# EasyEDA Pro project ESP32C3_Motor_MainControl.eprj, board ESP32C3RLogo
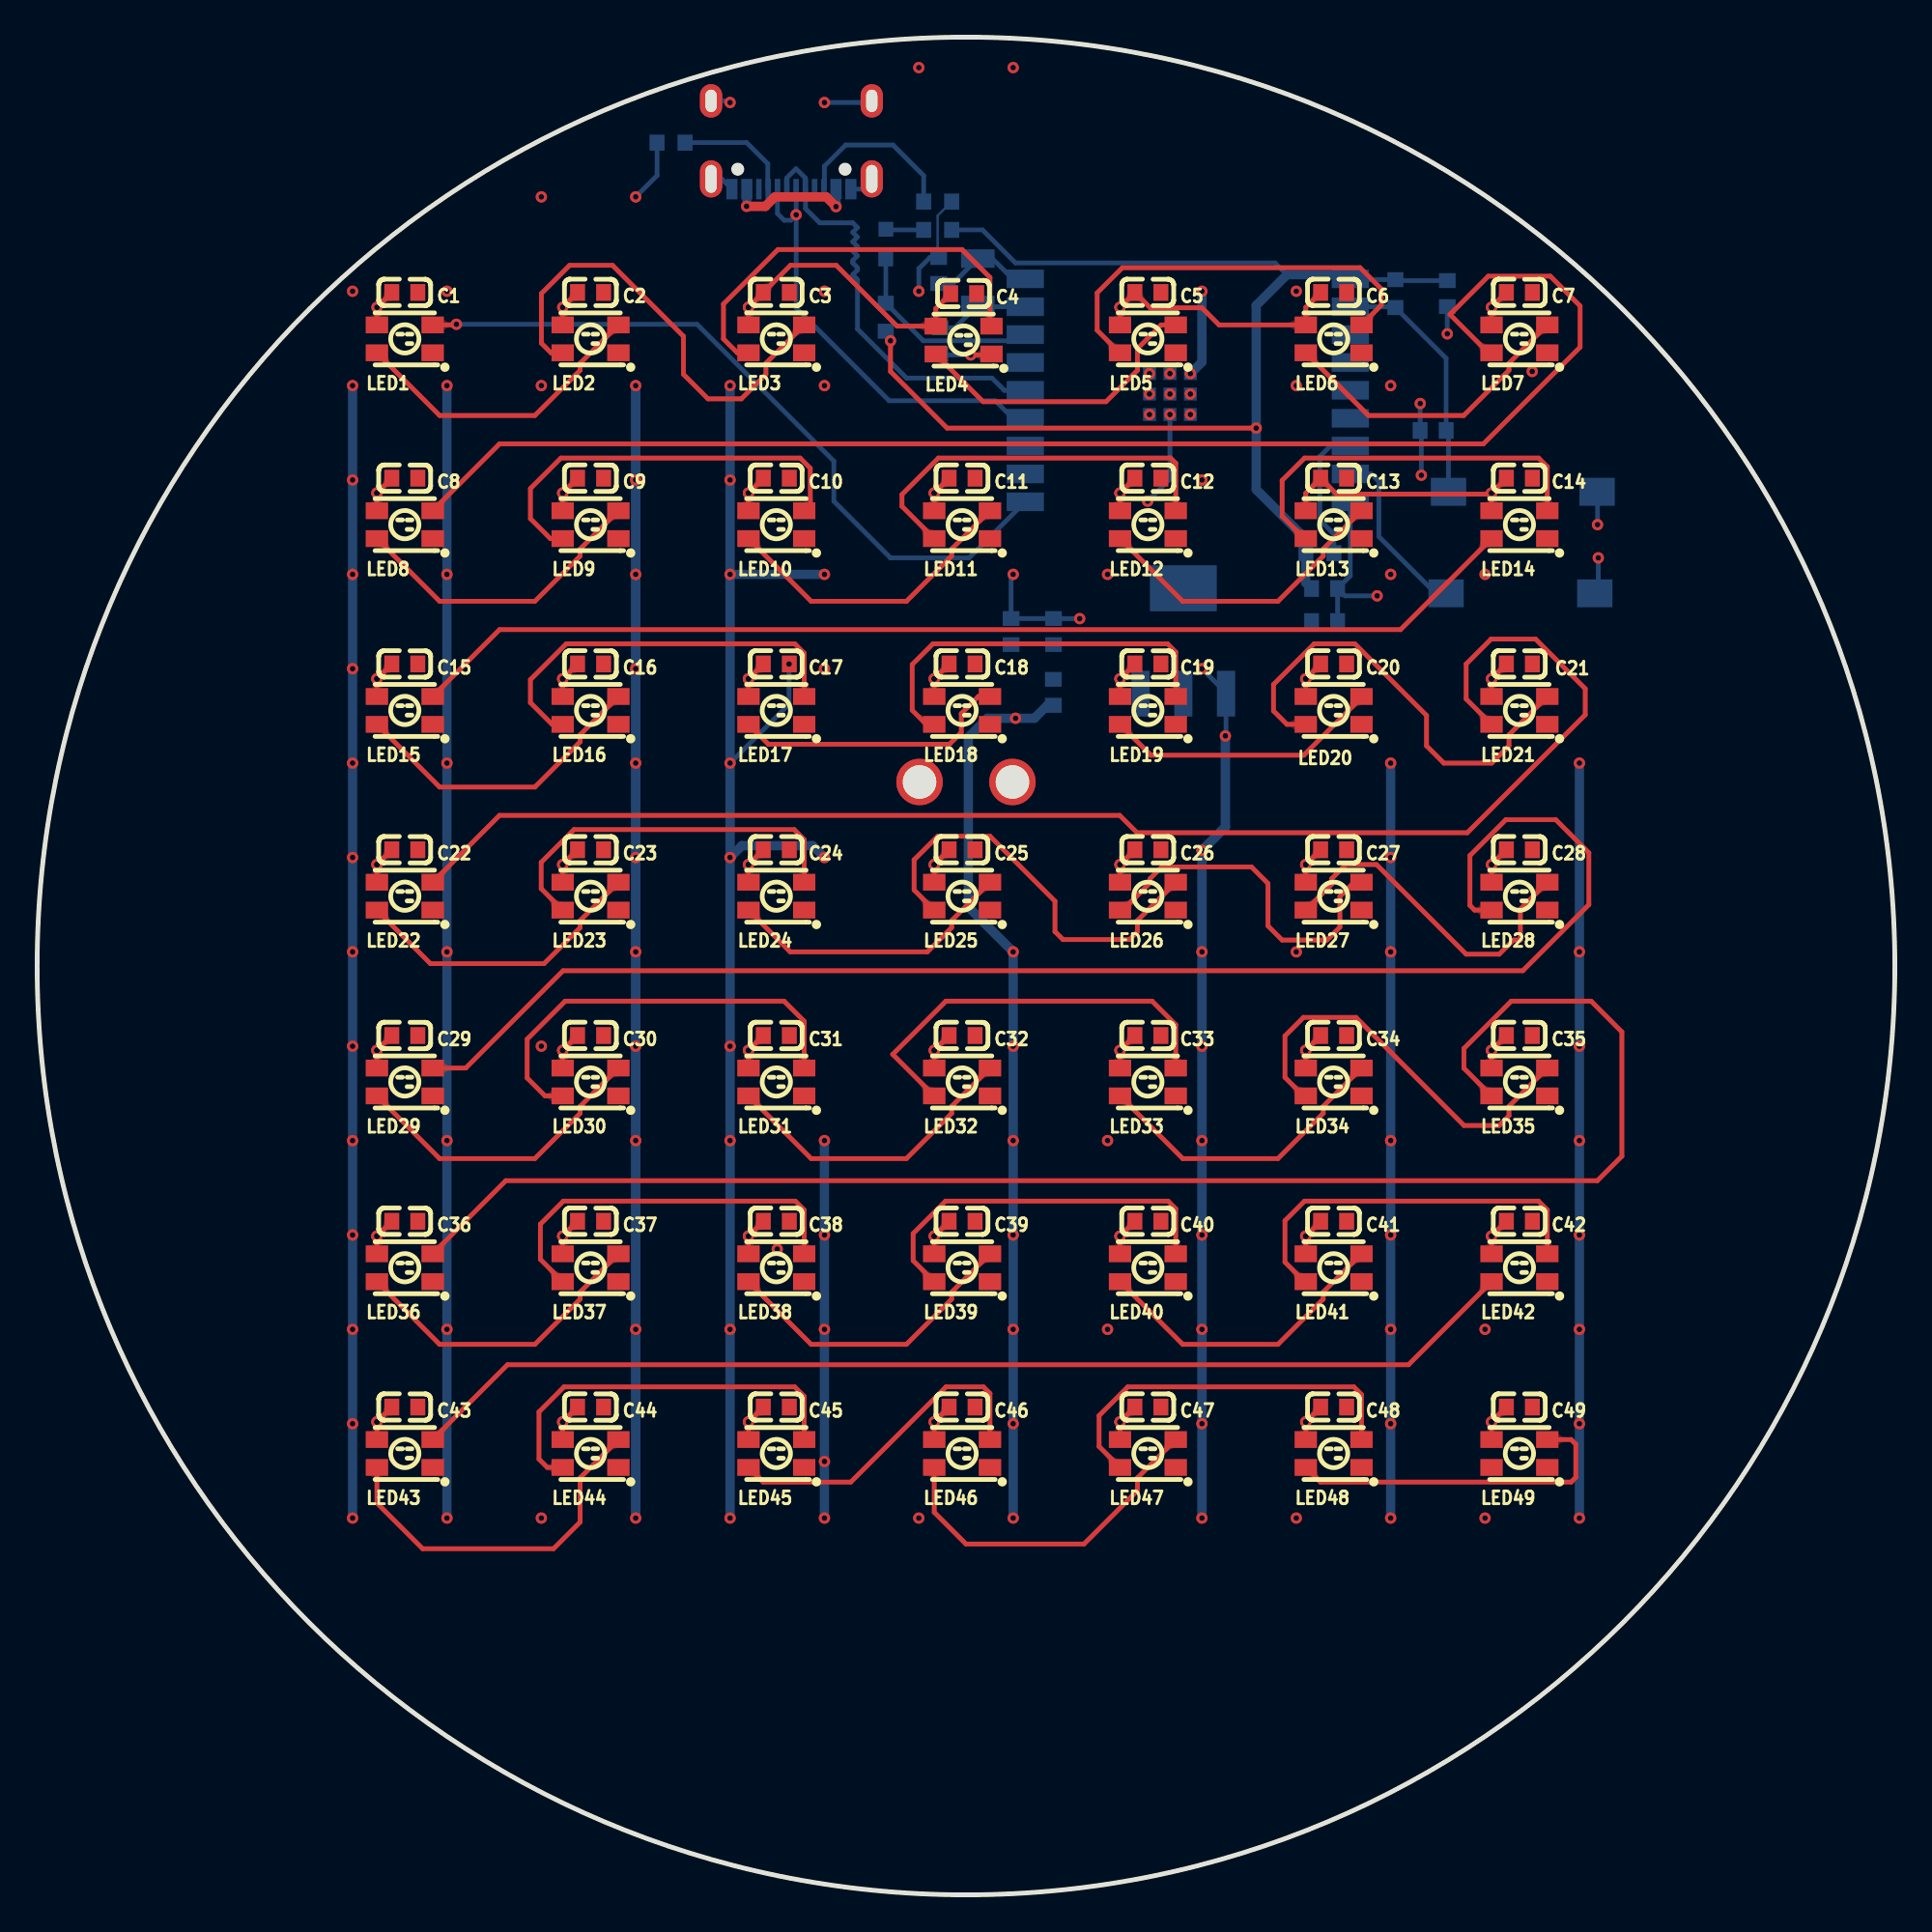
[diagram p5: board, top side]
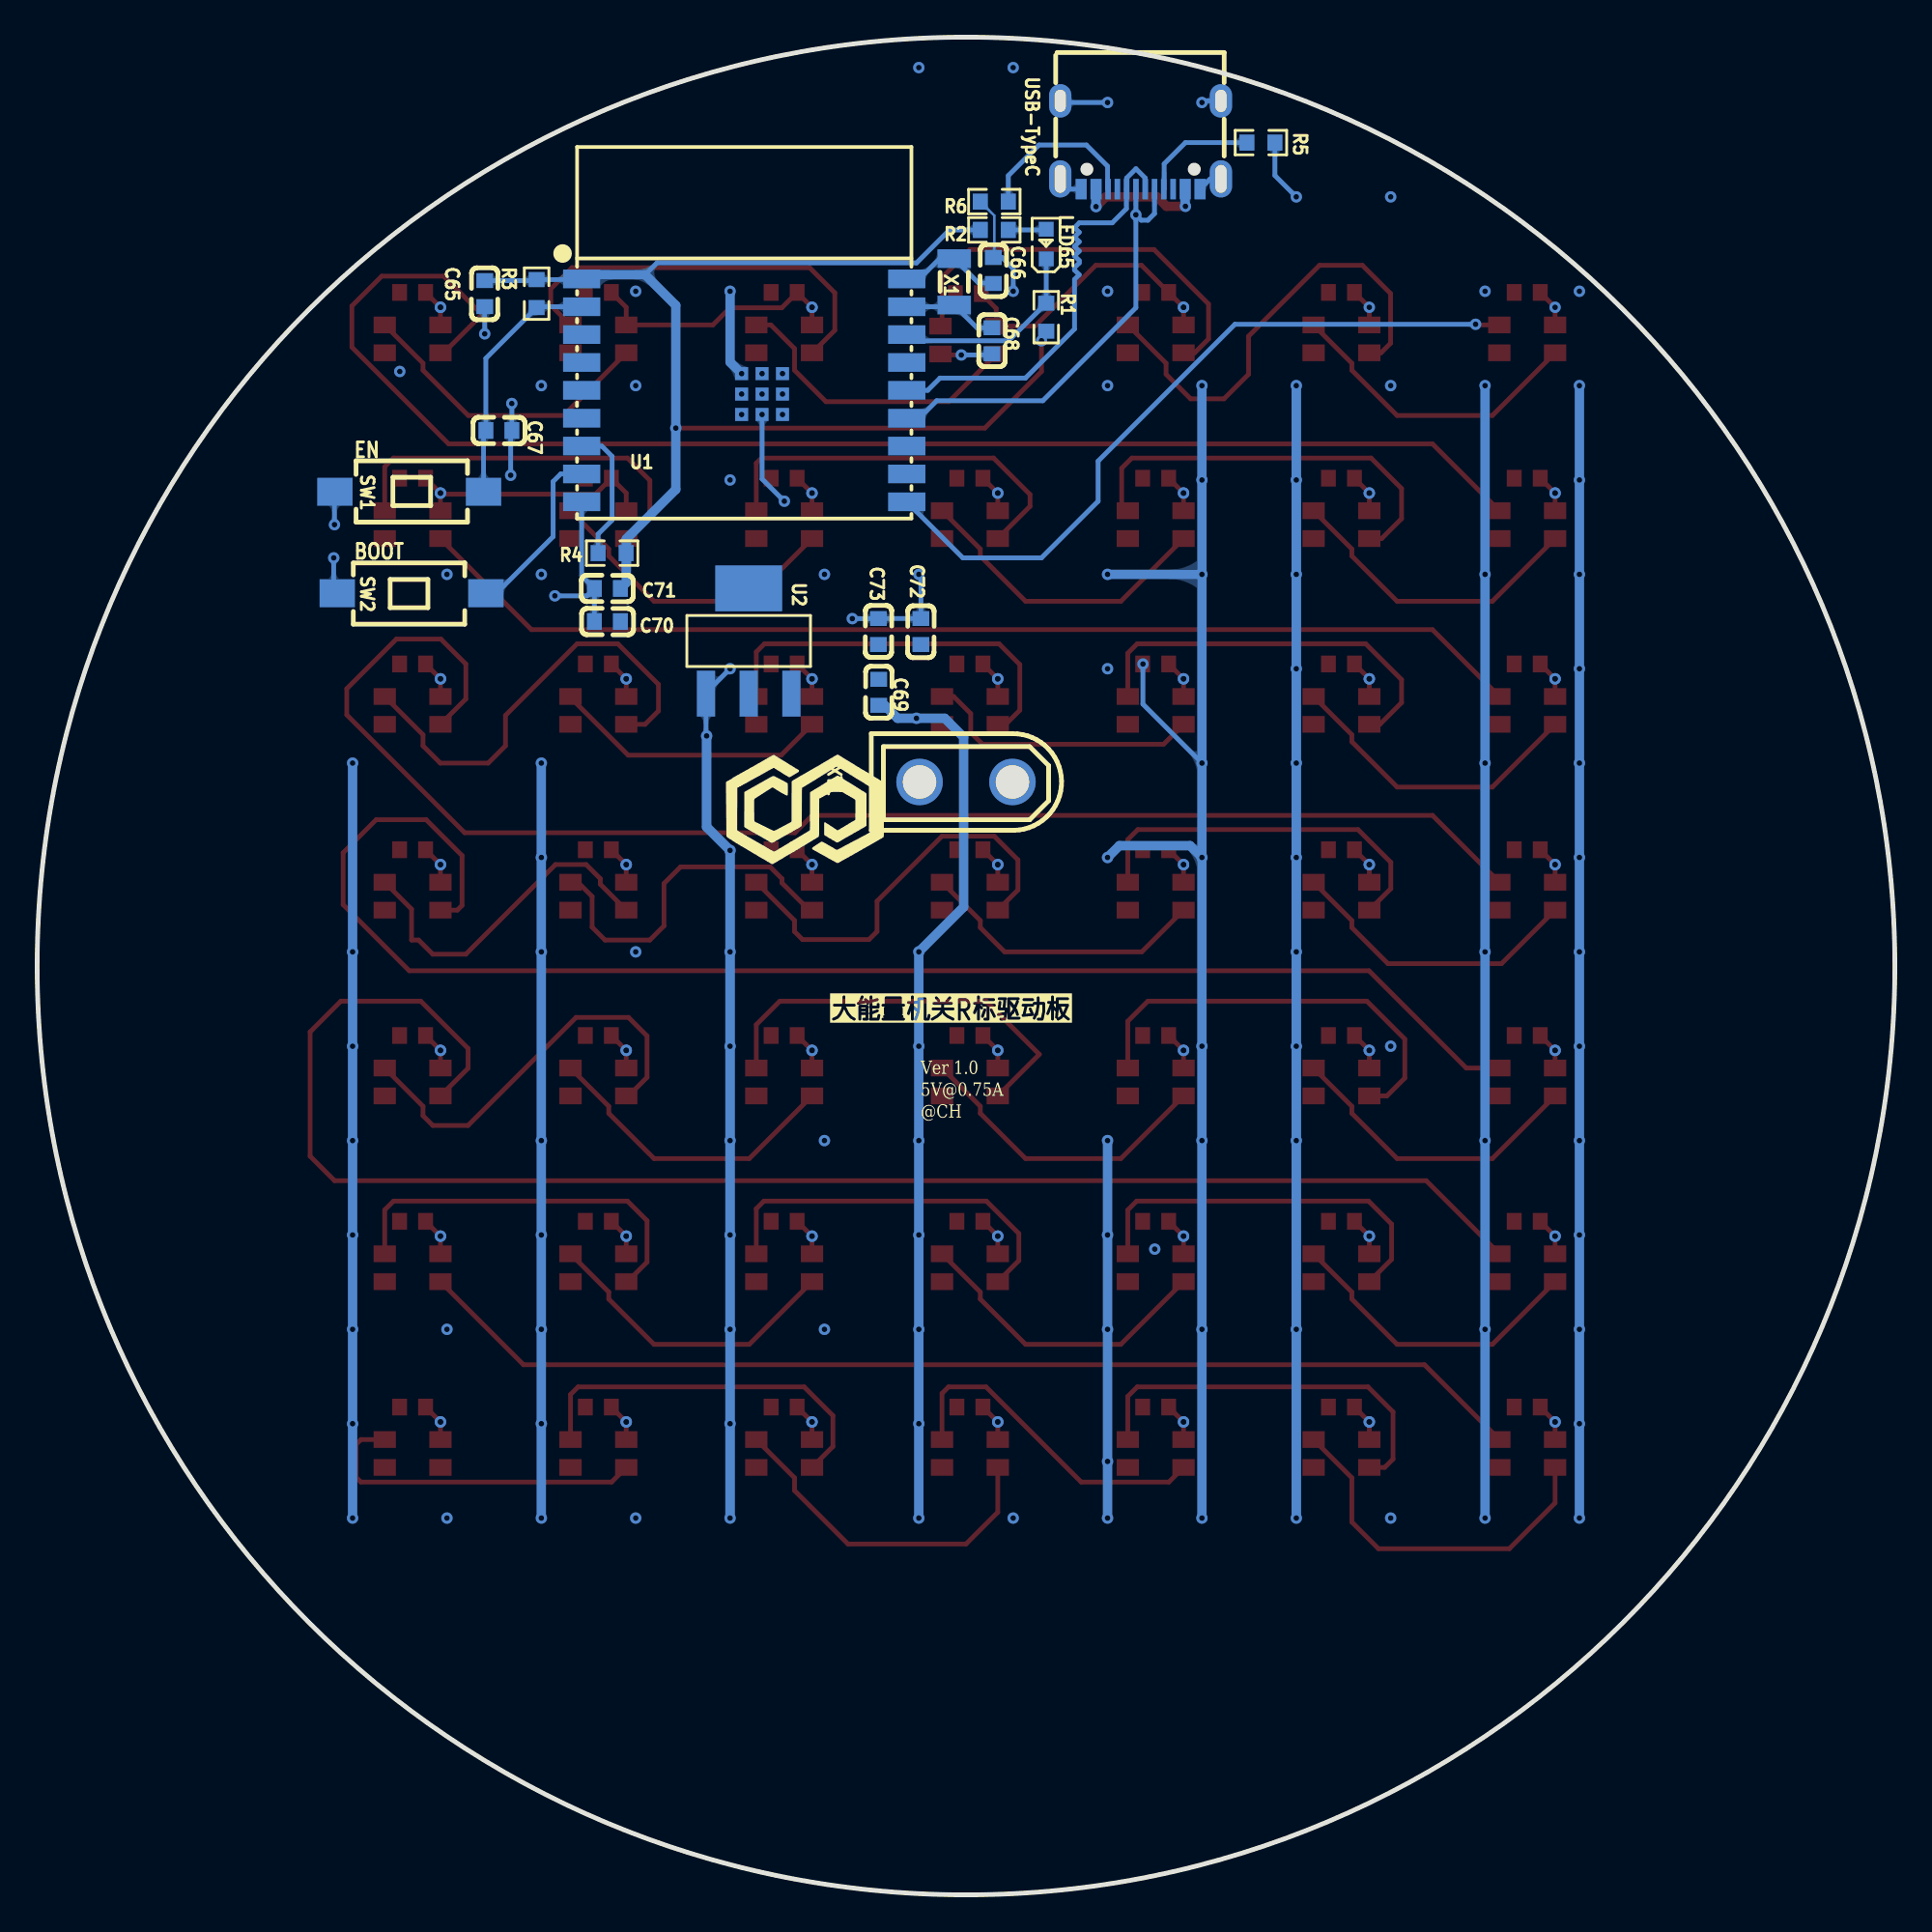
[diagram p6: board, bottom side, seen from below]

Outline 100 x 100 mm; copper layers: Top Layer, Bottom Layer. Coordinates in mm from the lower left corner of the outline.
Outline path: circle c50,50 r50
Stack: Top Layer 0.035mm / Dielectric1 1.51mm FR4 er 4.5 / Bottom Layer 0.035mm

## Design rules (mm)
net USB_DN: DP1
net USB_DP: DP1
template: 自定义配置
spacing copperThickness1oz (default): track to track 0.152, other pairs 0.152 to 0.3
spacing copperThickness2oz: track to track 0.203, other pairs 0.152 to 0.3
track width copperThickness1oz (default): min 0.127, default 0.254, max 2.54
track width copperThickness2oz: min 0.203, default 0.254, max 2.54
differential pair differentialPair (default): width min 0.127, default 0.254, max 2.54; gap min 0.152, default 0.152
via viaSize (default): diameter min 0.5, default 0.61, max 10; hole min 0.3, default 0.305, max 6.299

## Placement (name value [footprint] x y rotation side)
C1  100nF  [C0603]  19.79 86.26 0 top
C2  100nF  [C0603]  29.79 86.26 0 top
C3  100nF  [C0603]  39.79 86.26 0 top
C4  100nF  [C0603]  49.87 86.19 0 top
C5  100nF  [C0603]  59.79 86.26 0 top
C6  100nF  [C0603]  69.79 86.26 0 top
C7  100nF  [C0603]  79.79 86.26 0 top
C8  100nF  [C0603]  19.79 76.26 0 top
C9  100nF  [C0603]  29.79 76.26 0 top
C10  100nF  [C0603]  39.79 76.26 0 top
C11  100nF  [C0603]  49.79 76.26 0 top
C12  100nF  [C0603]  59.79 76.26 0 top
C13  100nF  [C0603]  69.79 76.26 0 top
C14  100nF  [C0603]  79.79 76.26 0 top
C15  100nF  [C0603]  19.79 66.26 0 top
C16  100nF  [C0603]  29.79 66.26 0 top
C17  100nF  [C0603]  39.79 66.26 0 top
C18  100nF  [C0603]  49.79 66.26 0 top
C19  100nF  [C0603]  59.79 66.26 0 top
C20  100nF  [C0603]  69.79 66.26 0 top
C21  100nF  [C0603]  79.79 66.26 0 top
C22  100nF  [C0603]  19.79 56.26 0 top
C23  100nF  [C0603]  29.79 56.26 0 top
C24  100nF  [C0603]  39.79 56.26 0 top
C25  100nF  [C0603]  49.79 56.26 0 top
C26  100nF  [C0603]  59.79 56.26 0 top
C27  100nF  [C0603]  69.79 56.26 0 top
C28  100nF  [C0603]  79.79 56.26 0 top
C29  100nF  [C0603]  19.79 46.26 0 top
C30  100nF  [C0603]  29.79 46.26 0 top
C31  100nF  [C0603]  39.79 46.26 0 top
C32  100nF  [C0603]  49.79 46.26 0 top
C33  100nF  [C0603]  59.79 46.26 0 top
C34  100nF  [C0603]  69.79 46.26 0 top
C35  100nF  [C0603]  79.79 46.26 0 top
C36  100nF  [C0603]  19.79 36.26 0 top
C37  100nF  [C0603]  29.79 36.26 0 top
C38  100nF  [C0603]  39.79 36.26 0 top
C39  100nF  [C0603]  49.79 36.26 0 top
C40  100nF  [C0603]  59.79 36.26 0 top
C41  100nF  [C0603]  69.79 36.26 0 top
C42  100nF  [C0603]  79.79 36.26 0 top
C43  100nF  [C0603]  19.79 26.26 0 top
C44  100nF  [C0603]  29.79 26.26 0 top
C45  100nF  [C0603]  39.79 26.26 0 top
C46  100nF  [C0603]  49.79 26.26 0 top
C47  100nF  [C0603]  59.79 26.26 0 top
C48  100nF  [C0603]  69.79 26.26 0 top
C49  100nF  [C0603]  79.79 26.26 0 top
C65  100nF  [C0603]  75.91 86.19 90 bottom
C66  12pF  [C0603]  48.53 87.44 90 bottom
C67  1uF  [C0603]  75.15 78.83 0 bottom
C68  12pF  [C0603]  48.6 83.66 270 bottom
C69  10uF  [C0603]  54.7 64.73 270 bottom
C70  10uF  [C0603]  69.3 68.54 0 bottom
C71  0.1uF  [C0603]  69.3 70.32 180 bottom
C72  0.1uF  [C0603]  52.43 68 90 bottom
C73  10uF  [C0603]  54.71 68 270 bottom
LED1  XL-3528RGBW-WS2812B  [LED-SMD_4P-L3.5-W2.8-BR-1]  19.79 83.76 0 top
LED2  XL-3528RGBW-WS2812B  [LED-SMD_4P-L3.5-W2.8-BR-1]  29.79 83.76 0 top
LED3  XL-3528RGBW-WS2812B  [LED-SMD_4P-L3.5-W2.8-BR-1]  39.79 83.76 0 top
LED4  XL-3528RGBW-WS2812B  [LED-SMD_4P-L3.5-W2.8-BR-1]  49.87 83.69 0 top
LED5  XL-3528RGBW-WS2812B  [LED-SMD_4P-L3.5-W2.8-BR-1]  59.79 83.76 0 top
LED6  XL-3528RGBW-WS2812B  [LED-SMD_4P-L3.5-W2.8-BR-1]  69.79 83.76 0 top
LED7  XL-3528RGBW-WS2812B  [LED-SMD_4P-L3.5-W2.8-BR-1]  79.79 83.76 0 top
LED8  XL-3528RGBW-WS2812B  [LED-SMD_4P-L3.5-W2.8-BR-1]  19.79 73.76 0 top
LED9  XL-3528RGBW-WS2812B  [LED-SMD_4P-L3.5-W2.8-BR-1]  29.79 73.76 0 top
LED10  XL-3528RGBW-WS2812B  [LED-SMD_4P-L3.5-W2.8-BR-1]  39.79 73.76 0 top
LED11  XL-3528RGBW-WS2812B  [LED-SMD_4P-L3.5-W2.8-BR-1]  49.79 73.76 0 top
LED12  XL-3528RGBW-WS2812B  [LED-SMD_4P-L3.5-W2.8-BR-1]  59.79 73.76 0 top
LED13  XL-3528RGBW-WS2812B  [LED-SMD_4P-L3.5-W2.8-BR-1]  69.79 73.76 0 top
LED14  XL-3528RGBW-WS2812B  [LED-SMD_4P-L3.5-W2.8-BR-1]  79.79 73.76 0 top
LED15  XL-3528RGBW-WS2812B  [LED-SMD_4P-L3.5-W2.8-BR-1]  19.79 63.76 0 top
LED16  XL-3528RGBW-WS2812B  [LED-SMD_4P-L3.5-W2.8-BR-1]  29.79 63.76 0 top
LED17  XL-3528RGBW-WS2812B  [LED-SMD_4P-L3.5-W2.8-BR-1]  39.79 63.76 0 top
LED18  XL-3528RGBW-WS2812B  [LED-SMD_4P-L3.5-W2.8-BR-1]  49.79 63.76 0 top
LED19  XL-3528RGBW-WS2812B  [LED-SMD_4P-L3.5-W2.8-BR-1]  59.79 63.76 0 top
LED20  XL-3528RGBW-WS2812B  [LED-SMD_4P-L3.5-W2.8-BR-1]  69.79 63.76 0 top
LED21  XL-3528RGBW-WS2812B  [LED-SMD_4P-L3.5-W2.8-BR-1]  79.79 63.76 0 top
LED22  XL-3528RGBW-WS2812B  [LED-SMD_4P-L3.5-W2.8-BR-1]  19.79 53.76 0 top
LED23  XL-3528RGBW-WS2812B  [LED-SMD_4P-L3.5-W2.8-BR-1]  29.79 53.76 0 top
LED24  XL-3528RGBW-WS2812B  [LED-SMD_4P-L3.5-W2.8-BR-1]  39.79 53.76 0 top
LED25  XL-3528RGBW-WS2812B  [LED-SMD_4P-L3.5-W2.8-BR-1]  49.79 53.76 0 top
LED26  XL-3528RGBW-WS2812B  [LED-SMD_4P-L3.5-W2.8-BR-1]  59.79 53.76 0 top
LED27  XL-3528RGBW-WS2812B  [LED-SMD_4P-L3.5-W2.8-BR-1]  69.79 53.76 0 top
LED28  XL-3528RGBW-WS2812B  [LED-SMD_4P-L3.5-W2.8-BR-1]  79.79 53.76 0 top
LED29  XL-3528RGBW-WS2812B  [LED-SMD_4P-L3.5-W2.8-BR-1]  19.79 43.76 0 top
LED30  XL-3528RGBW-WS2812B  [LED-SMD_4P-L3.5-W2.8-BR-1]  29.79 43.76 0 top
LED31  XL-3528RGBW-WS2812B  [LED-SMD_4P-L3.5-W2.8-BR-1]  39.79 43.76 0 top
LED32  XL-3528RGBW-WS2812B  [LED-SMD_4P-L3.5-W2.8-BR-1]  49.79 43.76 0 top
LED33  XL-3528RGBW-WS2812B  [LED-SMD_4P-L3.5-W2.8-BR-1]  59.79 43.76 0 top
LED34  XL-3528RGBW-WS2812B  [LED-SMD_4P-L3.5-W2.8-BR-1]  69.79 43.76 0 top
LED35  XL-3528RGBW-WS2812B  [LED-SMD_4P-L3.5-W2.8-BR-1]  79.79 43.76 0 top
LED36  XL-3528RGBW-WS2812B  [LED-SMD_4P-L3.5-W2.8-BR-1]  19.79 33.76 0 top
LED37  XL-3528RGBW-WS2812B  [LED-SMD_4P-L3.5-W2.8-BR-1]  29.79 33.76 0 top
LED38  XL-3528RGBW-WS2812B  [LED-SMD_4P-L3.5-W2.8-BR-1]  39.79 33.76 0 top
LED39  XL-3528RGBW-WS2812B  [LED-SMD_4P-L3.5-W2.8-BR-1]  49.79 33.76 0 top
LED40  XL-3528RGBW-WS2812B  [LED-SMD_4P-L3.5-W2.8-BR-1]  59.79 33.76 0 top
LED41  XL-3528RGBW-WS2812B  [LED-SMD_4P-L3.5-W2.8-BR-1]  69.79 33.76 0 top
LED42  XL-3528RGBW-WS2812B  [LED-SMD_4P-L3.5-W2.8-BR-1]  79.79 33.76 0 top
LED43  XL-3528RGBW-WS2812B  [LED-SMD_4P-L3.5-W2.8-BR-1]  19.79 23.76 0 top
LED44  XL-3528RGBW-WS2812B  [LED-SMD_4P-L3.5-W2.8-BR-1]  29.79 23.76 0 top
LED45  XL-3528RGBW-WS2812B  [LED-SMD_4P-L3.5-W2.8-BR-1]  39.79 23.76 0 top
LED46  XL-3528RGBW-WS2812B  [LED-SMD_4P-L3.5-W2.8-BR-1]  49.79 23.76 0 top
LED47  XL-3528RGBW-WS2812B  [LED-SMD_4P-L3.5-W2.8-BR-1]  59.79 23.76 0 top
LED48  XL-3528RGBW-WS2812B  [LED-SMD_4P-L3.5-W2.8-BR-1]  69.79 23.76 0 top
LED49  XL-3528RGBW-WS2812B  [LED-SMD_4P-L3.5-W2.8-BR-1]  79.79 23.76 0 top
LED65  NCD0603R1  [LED0603-RD_RED]  45.68 88.86 90 bottom
R1  10kΩ  [R0603]  45.68 84.92 90 bottom
R2  1kΩ  [R0603]  48.48 89.62 0 bottom
R3  10kΩ  [R0603]  73.11 86.19 90 bottom
R4  10kΩ  [R0603]  69.05 72.22 180 bottom
R5  5.1kΩ  [R0603]  34.12 94.32 0 bottom
R6  5.1kΩ  [R0603]  48.48 91.15 180 bottom
SW1  TS-1101-C-W  [SW-SMD_L6.0-W3.3-LS8.0]  79.97 75.53 0 bottom
SW2  TS-1101-C-W  [SW-SMD_L6.0-W3.3-LS8.0]  79.84 70.07 180 bottom
U1  2.4GHz  [BULETM-SMD_ESPRESSIF_ESP32-C3-WROOM-02-N4-4MB]  61.94 80.99 180 bottom
U2  AMS1117-3.3  [SOT-223-4_L6.5-W3.5-P2.30-LS7.0-BR]  61.7 67.5 270 bottom
USB-TypeC  TYPE-C 16PIN 2MD(073)  [USB-C-SMD_TYPE-C-6PIN-2MD-073]  40.6 94.2 0 bottom
X1  32.768kHz  [FC-135R_L3.2-W1.5]  50.63 86.83 90 bottom
XT1  XT30UPB-M  [CONN-TH_XT30UPB-M]  50 59.91 0 bottom

## Footprints (pads in the part's own frame, mm; a bottom-side part is the same pattern mirrored in y, then rotated)
BULETM-SMD_ESPRESSIF_ESP32-C3-WROOM-02-N4-4MB
  rect 2x1 smd: 1(-8.75,6) 2(-8.75,4.5) 3(-8.75,3) 4(-8.75,1.5) 5(-8.75,0) 6(-8.75,-1.5) 7(-8.75,-3) 8(-8.75,-4.5) 9(-8.75,-6) 10(8.75,-6) 11(8.75,-4.5) 12(8.75,-3) 13(8.75,-1.5) 14(8.75,0) 15(8.75,1.5) 16(8.75,3) 17(8.75,4.5) 18(8.75,6)
  rect 0.7x0.7 smd: 19(-0.14,-1.3) 19(-0.14,-0.2) 19(-0.14,0.9) 19(0.96,-1.3) 19(0.96,-0.2) 19(0.96,0.9) 19(2.06,-1.3) 19(2.06,-0.2) 19(2.06,0.9)
C0603
  rect 0.8x0.9 smd: 1(-0.7,0) 2(0.7,0)
CONN-TH_XT30UPB-M
  round 2.5 hole 1.8: 1(-2.5,0) 2(2.5,0)
FC-135R_L3.2-W1.5
  rect 1x1.8 smd: 1(-1.25,0) 2(1.25,0)
LED0603-RD_RED
  rect 0.8x0.8 smd: 1(-0.799,-0.004) 2(0.799,0.004)
LED-SMD_4P-L3.5-W2.8-BR-1
  rect 1.2x0.9 smd: 1(1.5,-0.75) 2(1.5,0.75) 3(-1.5,0.75) 4(-1.5,-0.75)
R0603
  rect 0.806x0.864 smd: 1(-0.753,0) 2(0.753,0)
SOT-223-4_L6.5-W3.5-P2.30-LS7.0-BR
  rect 2.47x0.98 smd: 1(2.835,-2.3) 2(2.835,0) 3(2.835,2.3)
  rect 2.47x3.6 smd: 4(-2.835,0)
SW-SMD_L6.0-W3.3-LS8.0
  rect 1.9x1.5 smd: 1(-4,0) 2(4,0)
USB-C-SMD_TYPE-C-6PIN-2MD-073
  rect 0.6x1.1 smd: 1(-3.2,2.375) 2(-2.4,2.375) 11(2.4,2.375) 12(3.2,2.375)
  rect 0.3x1.1 smd: 3(-1.75,2.375) 4(-1.25,2.375) 5(-0.75,2.375) 6(-0.25,2.375) 7(0.25,2.375) 8(0.75,2.375) 9(1.25,2.375) 10(1.75,2.375)
  oval 1.2x1.8 hole 0.6x1.2: 13(-4.325,-2.375) 14(4.325,-2.375)
  oval 1.2x2 hole 0.6x1.5: 13(-4.325,1.825) 14(4.325,1.825)

## Nets
GND: C1.2 C2.2 C3.2 C4.2 C5.2 C6.2 C7.2 C8.2 C9.2 C10.2 C11.2 C12.2 C13.2 C14.2 C15.2 C16.2 C17.2 C18.2 C19.2 C20.2 C21.2 C22.2 C23.2 C24.2 C25.2 C26.2 C27.2 C28.2 C29.2 C30.2 C31.2 C32.2 C33.2 C34.2 C35.2 C36.2 C37.2 C38.2 C39.2 C40.2 C41.2 C42.2 C43.2 C44.2 C45.2 C46.2 C47.2 C48.2 C49.2 C65.1 C66.2 C67.1 C68.2 C69.2 C70.2 C71.1 C72.2 C73.1 LED1.1 LED2.1 LED3.1 LED4.1 LED5.1 LED6.1 LED7.1 LED8.1 LED9.1 LED10.1 LED11.1 LED12.1 LED13.1 LED14.1 LED15.1 LED16.1 LED17.1 LED18.1 LED19.1 LED20.1 LED21.1 LED22.1 LED23.1 LED24.1 LED25.1 LED26.1 LED27.1 LED28.1 LED29.1 LED30.1 LED31.1 LED32.1 LED33.1 LED34.1 LED35.1 LED36.1 LED37.1 LED38.1 LED39.1 LED40.1 LED41.1 LED42.1 LED43.1 LED44.1 LED45.1 LED46.1 LED47.1 LED48.1 LED49.1 R5.1 R6.1 SW1.2 SW2.1 U1.9 U1.19 U2.1 USB-TypeC.1 USB-TypeC.12 USB-TypeC.13 USB-TypeC.14 XT1.1
VCC: C1.1 C2.1 C3.1 C4.1 C5.1 C6.1 C7.1 C8.1 C9.1 C10.1 C11.1 C12.1 C13.1 C14.1 C15.1 C16.1 C17.1 C18.1 C19.1 C20.1 C21.1 C22.1 C23.1 C24.1 C25.1 C26.1 C27.1 C28.1 C29.1 C30.1 C31.1 C32.1 C33.1 C34.1 C35.1 C36.1 C37.1 C38.1 C39.1 C40.1 C41.1 C42.1 C43.1 C44.1 C45.1 C46.1 C47.1 C48.1 C49.1 C69.1 C72.1 C73.2 LED1.3 LED2.3 LED3.3 LED4.3 LED5.3 LED6.3 LED7.3 LED8.3 LED9.3 LED10.3 LED11.3 LED12.3 LED13.3 LED14.3 LED15.3 LED16.3 LED17.3 LED18.3 LED19.3 LED20.3 LED21.3 LED22.3 LED23.3 LED24.3 LED25.3 LED26.3 LED27.3 LED28.3 LED29.3 LED30.3 LED31.3 LED32.3 LED33.3 LED34.3 LED35.3 LED36.3 LED37.3 LED38.3 LED39.3 LED40.3 LED41.3 LED42.3 LED43.3 LED44.3 LED45.3 LED46.3 LED47.3 LED48.3 LED49.3 U2.3 USB-TypeC.2 USB-TypeC.11 XT1.2
VCC_3V3: C65.2 C70.1 C71.2 R1.1 R2.2 R3.2 R4.2 U1.1 U2.2 U2.4
$1I10548/DO: LED49.4
BOOT: SW2.2 U1.8
DIN: LED1.2 U1.10
EN: C67.2 R3.1 SW1.1 U1.2
USB_DN: U1.13 USB-TypeC.5 USB-TypeC.7
USB_DP: U1.14 USB-TypeC.6 USB-TypeC.8
$1N818: C66.1 U1.18 X1.2
$1N819: C68.1 U1.17 X1.1
$1N821: R4.1 U1.7
$1N839: LED65.1 R1.2 U1.16
$1N846: LED65.2 R2.1
$1N1163: R5.2 USB-TypeC.4
$1N1164: R6.2 USB-TypeC.10
$1N10740: LED1.4 LED2.2
$1N10741: LED2.4 LED3.2
$1N10742: LED3.4 LED4.2
$1N10743: LED4.4 LED5.2
$1N10744: LED6.4 LED7.2
$1N10745: LED7.4 LED8.2
$1N10746: LED8.4 LED9.2
$1N10747: LED9.4 LED10.2
$1N10748: LED5.4 LED6.2
$1N10749: LED11.4 LED12.2
$1N10750: LED12.4 LED13.2
$1N10751: LED13.4 LED14.2
$1N10752: LED14.4 LED15.2
$1N10753: LED16.4 LED17.2
$1N10754: LED17.4 LED18.2
$1N10755: LED18.4 LED19.2
$1N10756: LED19.4 LED20.2
$1N10757: LED15.4 LED16.2
$1N10758: LED10.4 LED11.2
$1N10759: LED21.4 LED22.2
$1N10760: LED22.4 LED23.2
$1N10761: LED23.4 LED24.2
$1N10762: LED24.4 LED25.2
$1N10763: LED26.4 LED27.2
$1N10764: LED27.4 LED28.2
$1N10765: LED25.4 LED26.2
$1N10766: LED20.4 LED21.2
$1N10769: LED28.4 LED29.2
$1N10770: LED29.4 LED30.2
$1N10771: LED31.4 LED32.2
$1N10772: LED32.4 LED33.2
$1N10773: LED33.4 LED34.2
$1N10774: LED34.4 LED35.2
$1N10775: LED30.4 LED31.2
$1N10776: LED36.4 LED37.2
$1N10777: LED37.4 LED38.2
$1N10778: LED38.4 LED39.2
$1N10779: LED39.4 LED40.2
$1N10780: LED41.4 LED42.2
$1N10781: LED42.4 LED43.2
$1N10782: LED43.4 LED44.2
$1N10783: LED44.4 LED45.2
$1N10784: LED40.4 LED41.2
$1N10785: LED35.4 LED36.2
$1N10786: LED46.4 LED47.2
$1N10787: LED47.4 LED48.2
$1N10788: LED48.4 LED49.2
$1N10793: LED45.4 LED46.2

Pads without a net: U1 3 4 5 6 11 12 15; USB-TypeC 3 9

## Via types
v1: diameter 0.61, hole 0.305, Top Layer to Bottom Layer, 115 vias
v2: diameter 0.61, hole 0.304, Top Layer to Bottom Layer, 114 vias

## Routing (per net, layer and track width the routed paths; a pad name or vN(x,y) marks a point on that pad's centre or on a via; arc(x,y) is an arc through that point)
GND: length 510.4
  Top Layer w0.254: LED4.1 51.32,82.89 v1(50.25,82.89)
  Bottom Layer w0.128: R6.1 48.48,90.39 48.48,88.19 C66.2
  Bottom Layer w0.254: v2(37.3,96.48) 37.21,96.57 36.28,96.57 ; SW1.2 84,75.5 v1(84,73.76) ; USB-TypeC.12 44.38,91.82 USB-TypeC.14 ; C70.2 C71.1 ; C71.1 70.69,71 U1.9 ; C71.1 70.4,69.93 v1(72.13,69.93) ; v1(56.12,68.7) 54.72,68.7 C73.1 C72.2 52.43,70.97 v2(52.54,71.08) ; v1(50.25,82.89) 48.66,82.89 C68.2 ; 75.91,85.5 v1(75.91,84.03) ; USB-TypeC.14 44.84,96.48 v2(42.38,96.48) ; v2(62.7,66) 64,64.7 U2.1 64,62.42 v1(63.96,62.39) ; v2(47.46,86.32) 47.46,87.54 48.06,88.14 C66.2 ; SW2.1 84.04,70.26 v1(84.04,71.97) ; USB-TypeC.1 36.85,92.37 36.28,92.37 ; v2(59.78,75.02) 60.98,76.22 v1(60.98,79.69) ; v1(74.45,80.28) 74.45,80.28 C67.1 74.51,78.76 v1(74.51,76.42) ; v2(32.22,91.4) 33.37,92.55 R5.1 ; v2(37.3,60.92) 40.47,64.1 v2(40.47,66.26)
  Bottom Layer w0.5: v2(83.02,60.92) v2(83.02,50.76) v2(83.02,45.68) v2(83.02,40.6) v2(83.02,35.52) v2(83.02,30.44) v2(83.02,25.36) v2(83.02,20.28) ; v2(22.06,20.28) v2(22.06,30.44) v2(22.06,40.6) v2(22.06,50.76) v2(22.06,60.92) v2(22.06,71.08) v2(22.06,81.24) ; v2(72.86,20.28) v2(72.86,25.36) v2(72.86,30.44) v2(72.86,35.52) v2(72.86,40.6) v2(72.86,50.76) v2(72.86,55.84) v2(72.86,60.92) ; v2(42.38,20.28) v1(42.38,23.33) v2(42.38,30.44) v2(42.38,35.52) v2(42.38,40.6) ; v2(37.3,81.24) v2(37.3,76.16) v2(37.3,71.08) ; v2(37.3,71.08) v2(37.3,60.92) v2(37.3,55.84) ; v2(37.3,71.08) v2(42.38,71.08) ; v1(62.08,81.89) 62.7,82.51 v2(62.7,86.32) ; v2(42.38,55.84) 41.75,56.48 37.94,56.48 v2(37.3,55.84) ; v2(52.54,20.28) v2(52.54,25.36) v2(52.54,30.44) v2(52.54,35.52) v2(52.54,40.6) v2(52.54,45.68) v2(52.54,50.76) 50.13,53.17 50.13,62.32 51.14,63.33 v2(52.67,63.33) 53.68,63.33 54.38,64.03 C69.2 ; v2(37.3,55.84) v2(37.3,45.68) v2(37.3,40.6) v2(37.3,30.44) v2(37.3,20.28) ; v2(16.98,20.28) v2(16.98,25.36) v2(16.98,30.44) v2(16.98,35.52) v2(16.98,40.6) v2(16.98,45.68) v2(16.98,50.76) v2(16.98,55.84) v2(16.98,60.92) v2(16.98,66) v2(16.98,71.08) v2(16.98,76.16) v2(16.98,81.24)
  Bottom Layer w0.512: v2(32.22,81.24) v2(32.22,76.16) v2(32.22,71.08) v2(32.22,66) v2(32.22,60.92) v2(32.22,55.84) v2(32.22,50.76) v2(32.22,45.68) v2(32.22,40.6) v2(32.22,30.44) v2(32.22,20.28) ; v2(62.7,20.28) v2(62.7,25.36) v2(62.7,30.44) v2(62.7,35.52) v2(62.7,40.6) v2(62.7,45.68) v2(62.7,50.76) v2(62.7,56.22) 63.96,57.49 v1(63.96,62.39)
  vias: v1(59.88,81.89) v1(59.88,80.79) v1(59.88,79.69) v1(60.98,81.89) v1(60.98,80.79) v1(62.08,80.79) v1(62.08,79.69) v2(16.98,86.32) v2(22.06,86.32) v2(27.14,91.4) v2(27.14,81.24) v2(27.14,45.68) v2(27.14,20.28) v2(39.84,34.76) v2(42.38,86.32) v2(42.38,81.24) v2(42.38,66) v2(47.46,98.36) v2(47.46,20.28) v2(52.54,98.36) v2(57.62,71.08) v2(57.62,40.6) v2(57.62,30.44) v2(62.7,76.16) v2(67.78,86.32) v2(67.78,81.24) v2(67.78,50.76) v2(67.78,20.28) v2(72.86,81.24) v2(72.86,71.08) v2(77.94,71.08) v2(77.94,30.44) v2(77.94,20.28) v2(80.48,82)
VCC: length 139.9
  Top Layer w0.254: C41.1 v1(68.29,35.46) LED41.3 ; LED42.3 v1(78.29,35.46) C42.1 ; C6.1 68.29,85.46 LED6.3 63.62,84.51 62.7,85.43 59.91,85.43 C5.1 v1(58.29,85.46) LED5.3 ; C49.1 v1(78.29,25.46) LED49.3 ; LED22.3 v1(18.29,55.46) C22.1 ; 48.29,84.51 48.37,84.59 48.37,85.39 49.09,86.11 49.09,86.26 ; C15.1 v1(18.29,65.46) LED15.3 ; C19.1 v1(58.29,65.46) LED19.3 ; v1(78.29,75.46) 78.23,75.4 69.95,75.4 C13.1 68.29,75.46 LED13.3 ; v1(78.29,75.46) LED14.3 ; v1(78.29,75.46) C14.1 ; C31.1 v1(38.29,45.46) LED31.3 ; C18.1 v1(48.29,65.46) LED18.3 ; LED4.3 46.29,84.44 43.01,87.72 40.55,87.72 C3.1 v1(38.29,85.46) LED3.3 ; LED21.3 v1(78.29,65.46) C21.1 ; LED37.3 v1(28.29,35.46) C37.1 ; LED8.3 v1(18.29,75.46) C8.1 ; LED2.3 v1(28.29,85.46) C2.1 ; LED29.3 v1(18.29,45.46) C29.1 ; LED47.3 v1(58.29,25.46) C47.1 ; C24.1 v1(38.29,55.46) LED24.3 ; C46.1 v1(48.29,25.46) LED46.3 ; LED40.3 v1(58.29,35.46) C40.1 ; LED17.3 v1(38.29,65.46) C17.1 ; C7.1 v1(78.29,85.46) LED7.3 ; C11.1 v1(48.29,75.46) LED11.3 ; C34.1 v1(68.29,45.46) LED34.3 ; C9.1 v1(28.29,75.46) LED9.3 ; LED33.3 v1(58.29,45.46) C33.1 ; LED48.3 v1(68.29,25.46) C48.1 ; C20.1 v1(68.29,65.46) LED20.3 ; C12.1 v1(58.29,75.46) LED12.3 ; LED27.3 v1(68.29,55.46) C27.1 ; LED28.3 v1(78.29,55.46) C28.1 ; LED10.3 v1(38.29,75.46) C10.1 ; C36.1 v1(18.29,35.46) LED36.3 ; C39.1 v1(48.29,35.46) LED39.3 ; LED16.3 v1(28.29,65.46) C16.1 ; LED45.3 v1(38.29,25.46) C45.1 ; LED43.3 v1(18.29,25.46) C43.1 ; C23.1 v1(28.29,55.46) LED23.3 ; C44.1 v1(28.29,25.46) LED44.3 ; C26.1 v1(58.29,55.46) LED26.3 ; LED25.3 v1(48.29,55.46) C25.1 ; C1.1 v1(18.29,85.46) LED1.3 ; C30.1 v1(28.29,45.46) LED30.3 ; LED38.3 v1(38.29,35.46) C38.1 ; LED35.3 v1(78.29,45.46) C35.1 ; LED32.3 v1(48.29,45.46) C32.1
  Top Layer w0.5: v1(38.19,90.89) 39.21,90.89 39.71,91.4 42.48,91.4 v1(43,90.88)
  Bottom Layer w0.5: v1(38.19,90.89) 38.2,90.91 USB-TypeC.2 ; USB-TypeC.11 v1(43,90.88)
VCC_3V3: length 69.8
  Top Layer w0.254: v1(45.94,83.66) 45.94,82 48.98,78.96 v1(65.62,78.96)
  Bottom Layer w0.254: C65.2 73.17,86.89 R3.2 70.73,86.95 U1.1 ; R2.2 50.89,89.62 52.66,87.85 66.64,87.85 67.27,87.21 ; v1(45.94,83.66) 45.94,83.92 R1.1
  Bottom Layer w0.5: C71.2 68.29,70.64 68.29,72.99 65.62,75.65 v1(65.62,78.96) 65.62,85.56 67.27,87.21 70.47,87.21 U1.1
BOOT: length 9.6
  Bottom Layer w0.254: U1.8 71.81,76.49 72.22,76.08 72.22,73.11 75.27,70.07 SW2.2
DIN: length 39.6
  Top Layer w0.254: v1(22.57,84.54) 22.53,84.51 LED1.2
  Bottom Layer w0.254: U1.10 50.17,71.97 45.94,71.97 42.89,75.02 42.89,77.18 35.52,84.54 v1(22.57,84.54)
EN: length 13.5
  Bottom Layer w0.254: U1.2 73.07,85.49 R3.1 75.85,82.71 C67.2 75.97,78.7 SW1.1
USB_DN: length 23.8
  Bottom Layer w0.254: USB-TypeC.5 39.85,90.5 40.21,90.15 40.57,90.15 v1(40.86,90.44) ; USB-TypeC.7 40.86,91.82 v1(40.86,90.44) ; v1(40.86,90.44) 40.86,85.43 45.86,80.43 51.57,80.43 52.52,79.49 U1.13
USB_DP: length 23.8
  Bottom Layer w0.254: USB-TypeC.6 40.35,92.42 40.85,92.92 41.35,92.42 USB-TypeC.8 41.36,91.81 41.36,90.77 42.13,90 43.9,90 44.16,89.75 43.9,89.5 44.16,89.24 43.9,88.99 44.16,88.73 43.9,88.48 44.16,88.23 43.9,87.97 43.9,87.85 44.16,87.59 44.16,87.47 43.9,87.21 44.16,86.96 44.16,84.29 46.8,81.65 51.4,81.65 52.06,80.99 U1.14
$1N818: length 5.6
  Bottom Layer w0.254: 48.6,86.77 49.32,86.77 X1.2 51.42,88.08 52.51,86.99 U1.18
$1N819: length 5.1
  Bottom Layer w0.254: C68.1 49.41,84.36 X1.1 50.73,85.49 U1.17
$1N821: length 7.4
  Bottom Layer w0.254: U1.7 69.61,77.99 69.05,77.43 69.05,74 69.8,73.25 R4.1
$1N839: length 10.9
  Bottom Layer w0.254: LED65.1 45.68,88.06 R1.2 47.71,83.66 52.85,83.66 U1.16
$1N846: length 2.1
  Bottom Layer w0.254: LED65.2 45.72,89.62 R2.1
$1N1163: length 6.3
  Bottom Layer w0.254: USB-TypeC.4 39.33,91.84 39.33,93.18 38.19,94.32 R5.2
$1N1164: length 9.1
  Bottom Layer w0.254: USB-TypeC.10 42.38,91.85 42.38,93.05 43.52,94.2 46.07,94.2 47.72,92.55 R6.2
$1N10740: length 16.6
  Top Layer w0.254: LED1.4 21.67,79.63 26.79,79.63 29.23,82.07 29.23,82.45 LED2.2
$1N10741: length 25
  Top Layer w0.254: LED3.2 39.23,82.45 39.23,81.85 37.91,80.53 36.11,80.53 34.79,81.85 34.79,83.9 30.97,87.72 28.66,87.72 27.14,86.2 27.14,83.52 27.66,83.01 LED2.4
$1N10742: length 22.3
  Top Layer w0.254: LED3.4 37.69,83.01 36.94,83.76 36.94,85.64 39.88,88.57 49.79,88.57 51.29,87.06 51.29,84.51
$1N10743: length 16.5
  Top Layer w0.254: 48.29,83.01 50.92,80.38 57.54,80.38 59.23,82.07 59.23,83.23 60.5,84.51 LED5.2
$1N10744: length 16.6
  Top Layer w0.254: LED6.4 71.66,79.63 76.79,79.63 79.23,82.07 79.23,82.45 LED7.2
$1N10745: length 79.2
  Top Layer w0.254: LED7.4 78.12,83.01 76.05,85.07 78.12,87.13 81.45,87.13 83.06,85.53 83.06,83.31 77.85,78.11 24.89,78.11 LED8.2
$1N10746: length 16.6
  Top Layer w0.254: LED8.4 21.67,69.63 26.79,69.63 29.23,72.07 29.23,72.45 LED9.2
$1N10747: length 22.2
  Top Layer w0.254: LED10.2 41.62,74.84 41.62,76.8 41.07,77.34 28.19,77.34 26.55,75.7 26.55,74.08 27.63,73.01 LED9.4
$1N10748: length 22.5
  Top Layer w0.254: LED5.4 58.27,83.01 57.06,84.22 57.06,86.24 58.42,87.59 71.21,87.59 72.35,86.45 72.35,85.57 LED6.2
$1N10749: length 21.3
  Top Layer w0.254: LED12.2 61.29,77.06 61.01,77.34 48.51,77.34 46.55,75.38 46.55,74.74 LED11.4
$1N10750: length 16.6
  Top Layer w0.254: LED13.2 69.23,72.45 69.23,72.07 66.79,69.63 61.66,69.63 LED12.4
$1N10751: length 21
  Top Layer w0.254: LED14.2 81.29,76.88 80.82,77.34 68.22,77.34 67.02,76.14 67.02,74.21 68.22,73.01 LED13.4
$1N10752: length 60.5
  Top Layer w0.254: LED14.4 73.39,68.11 24.89,68.11 LED15.2
$1N10753: length 21.5
  Top Layer w0.254: LED17.2 41.29,66.84 40.78,67.34 28.48,67.34 26.55,65.42 26.55,64.18 27.72,63.01 LED16.4
$1N10754: length 15.1
  Top Layer w0.254: LED18.2 50.66,64.51 49.75,63.59 49.75,62.57 49.11,61.94 39.36,61.94 LED17.4
$1N10755: length 21.2
  Top Layer w0.254: LED19.2 61.29,66.9 60.85,67.34 48.22,67.34 47.1,66.23 47.1,63.77 47.86,63.01 LED18.4
$1N10756: length 15
  Top Layer w0.254: LED20.2 71.29,64.45 68.19,61.35 59.95,61.35 LED19.4
$1N10757: length 16.6
  Top Layer w0.254: LED16.2 29.23,62.45 29.23,62.07 26.79,59.63 21.67,59.63 LED15.4
$1N10758: length 16.6
  Top Layer w0.254: LED11.2 49.23,72.45 49.23,72.07 46.79,69.63 41.66,69.63 LED10.4
$1N10759: length 79.8
  Top Layer w0.254: LED22.2 24.89,58.11 58.28,58.11 59.21,57.17 76.99,57.17 83.33,63.52 83.33,64.93 80.66,67.6 78.27,67.6 76.92,66.26 76.92,64.37 LED21.4
$1N10760: length 16.2
  Top Layer w0.254: LED22.4 21.17,50.13 27.29,50.13 29.23,52.07 29.23,52.45 LED23.2
$1N10761: length 20.5
  Top Layer w0.254: LED24.2 41.29,56.81 40.75,57.34 28.9,57.34 27.13,55.58 27.13,54.17 LED23.4
$1N10762: length 15.7
  Top Layer w0.254: LED25.2 49.23,52.45 49.23,52.07 47.92,50.76 40.54,50.76 LED24.4
$1N10763: length 19.3
  Top Layer w0.254: LED27.2 70.89,54.51 70.13,53.74 70.13,52.09 69.43,51.4 67.02,51.4 66.26,52.16 66.26,54.44 65.37,55.33 60.54,55.33 59.91,54.7 59.91,54.47 58.44,53.01 LED26.4
$1N10764: length 18.8
  Top Layer w0.254: LED27.4 69.69,54.4 69.69,54.7 70.45,55.46 72.1,55.46 76.92,50.64 78.7,50.64 79.46,51.4 79.84,51.4 79.84,53.06 LED28.2
$1N10765: length 22.7
  Top Layer w0.254: LED26.2 59.23,52.45 59.23,51.85 58.8,51.42 55.22,51.42 54.79,51.85 54.79,53.49 51.29,56.99 48.48,56.99 47.21,55.72 47.21,54.09 LED25.4
$1N10766: length 24.6
  Top Layer w0.254: LED20.4 67.28,63.01 66.55,63.73 66.55,65.16 68.74,67.34 70.93,67.34 74.79,63.49 74.79,61.85 75.72,60.92 78.3,60.92 79.23,61.85 79.23,62.45 LED21.2
$1N10769: length 80.6
  Top Layer w0.254: LED28.4 77.38,53.01 77.13,53.26 77.13,55.94 79.06,57.87 81.75,57.87 83.53,56.1 83.53,53.3 79.97,49.75 28.31,49.75 23.07,44.51 LED29.2
$1N10770: length 16.6
  Top Layer w0.254: LED30.2 29.23,42.45 29.23,42.07 26.79,39.63 21.67,39.63 LED29.4
$1N10771: length 16.6
  Top Layer w0.254: LED32.2 49.23,42.45 49.23,42.07 46.79,39.63 41.66,39.63 LED31.4
$1N10772: length 22.4
  Top Layer w0.254: LED32.4 46.05,45.24 48.92,48.11 60.02,48.11 61.29,46.84 LED33.2
$1N10773: length 16.6
  Top Layer w0.254: LED34.2 69.23,42.45 69.23,42.07 66.79,39.63 61.66,39.63 LED33.4
$1N10774: length 22.3
  Top Layer w0.254: LED35.2 79.23,42.45 79.23,41.94 78.7,41.42 76.81,41.42 70.99,47.23 68.17,47.23 67.17,46.24 67.17,44 68.17,43.01 LED34.4
$1N10775: length 23.1
  Top Layer w0.254: LED30.4 27.34,43.01 26.38,43.97 26.38,46.06 28.42,48.11 40.21,48.11 41.29,47.03 LED31.2
$1N10776: length 16.6
  Top Layer w0.254: LED37.2 29.23,32.45 29.23,32.07 26.79,29.63 21.67,29.63 LED36.4
$1N10777: length 20.9
  Top Layer w0.254: LED37.4 27.09,34.21 27.09,36.11 28.33,37.34 40.81,37.34 41.29,36.87 LED38.2
$1N10778: length 16.6
  Top Layer w0.254: LED39.2 49.23,32.45 49.23,32.07 46.79,29.63 41.66,29.63 LED38.4
$1N10779: length 20.5
  Top Layer w0.254: LED40.2 61.29,36.93 60.88,37.34 48.9,37.34 47.16,35.6 47.16,34.14 LED39.4
$1N10780: length 20.9
  Top Layer w0.254: LED42.2 81.29,36.87 80.82,37.34 68.22,37.34 67.17,36.29 67.17,34.06 68.22,33.01 LED41.4
$1N10781: length 60.5
  Top Layer w0.254: LED43.2 25.32,28.54 73.82,28.54 LED42.4
$1N10782: length 19.8
  Top Layer w0.254: LED44.2 29.23,22.45 29.23,20.07 27.79,18.63 20.75,18.63 18.29,21.09 LED43.4
$1N10783: length 21.4
  Top Layer w0.254: LED44.4 27.46,23.01 27.01,23.46 27.01,26 28.36,27.34 40.78,27.34 41.29,26.83 LED45.2
$1N10784: length 16.6
  Top Layer w0.254: LED41.2 69.23,32.45 69.23,32.07 66.79,29.63 61.66,29.63 LED40.4
$1N10785: length 86.3
  Top Layer w0.254: LED35.4 76.8,44.49 76.8,45.56 79.35,48.11 83.65,48.11 85.31,46.45 85.31,39.76 83.99,38.44 25.22,38.44 LED36.2
$1N10786: length 18.9
  Top Layer w0.254: LED46.4 48.29,20.59 50,18.88 56.35,18.88 59.23,21.76 59.23,22.45 LED47.2
$1N10787: length 20.6
  Top Layer w0.254: LED48.2 71.29,26.93 70.88,27.34 58.71,27.34 57.16,25.79 57.16,24.13 LED47.4
$1N10788: length 18.4
  Top Layer w0.254: LED49.2 82.57,24.51 82.83,24.25 82.83,22.47 82.57,22.22 69.08,22.22 LED48.4
$1N10793: length 18.1
  Top Layer w0.254: LED45.4 39.08,22.22 43.8,22.22 48.92,27.34 50.94,27.34 51.29,26.99 LED46.2

## Copper pours and planes (outline as drawn; the poured copper is in the pictures)
GND on Top Layer: -2.7,102.83 103.39,102.83 103.39,-2.32 -2.7,-2.32
VCC on Bottom Layer: -2.58,102.83 103.9,102.83 103.9,-2.32 -2.58,-2.32
VCC on Bottom Layer: 55.64,61.36 56.48,62.19 56.48,64.33 55.85,64.83 53.95,64.83 52.43,66.35 51.81,66.35 51.52,66.64 51.52,67.57 51.9,67.94 58.33,67.94 60.43,65.84 60.43,58.39 59.21,57.17 51.52,57.17 50.87,57.82 50.87,60.76 51.47,61.36
VCC_3V3 on Bottom Layer: 61.7,71.56 69.06,71.56 69.06,65.55 65.6,65.55 65.02,66.12 62.92,66.12 61.7,67.35
VCC_3V3 on Bottom Layer: 59.79,71.56 59.79,67.37 60.81,66.35 60.81,63.43 62.92,63.43 62.92,66.56 63.35,66.99 63.35,71.56

Small or netless copper shapes (teardrops, artwork), in the pictures only: 382 on Top Layer, 103 on Bottom Layer

## Text on the board
Bottom Silkscreen Layer: EN | BOOT | Ver 1.0 / 5V@0.75A / @CH | 大能量机关R标驱动板
